# EAGLE schematic controll_8motor_dac (EAGLE 9.3.2)
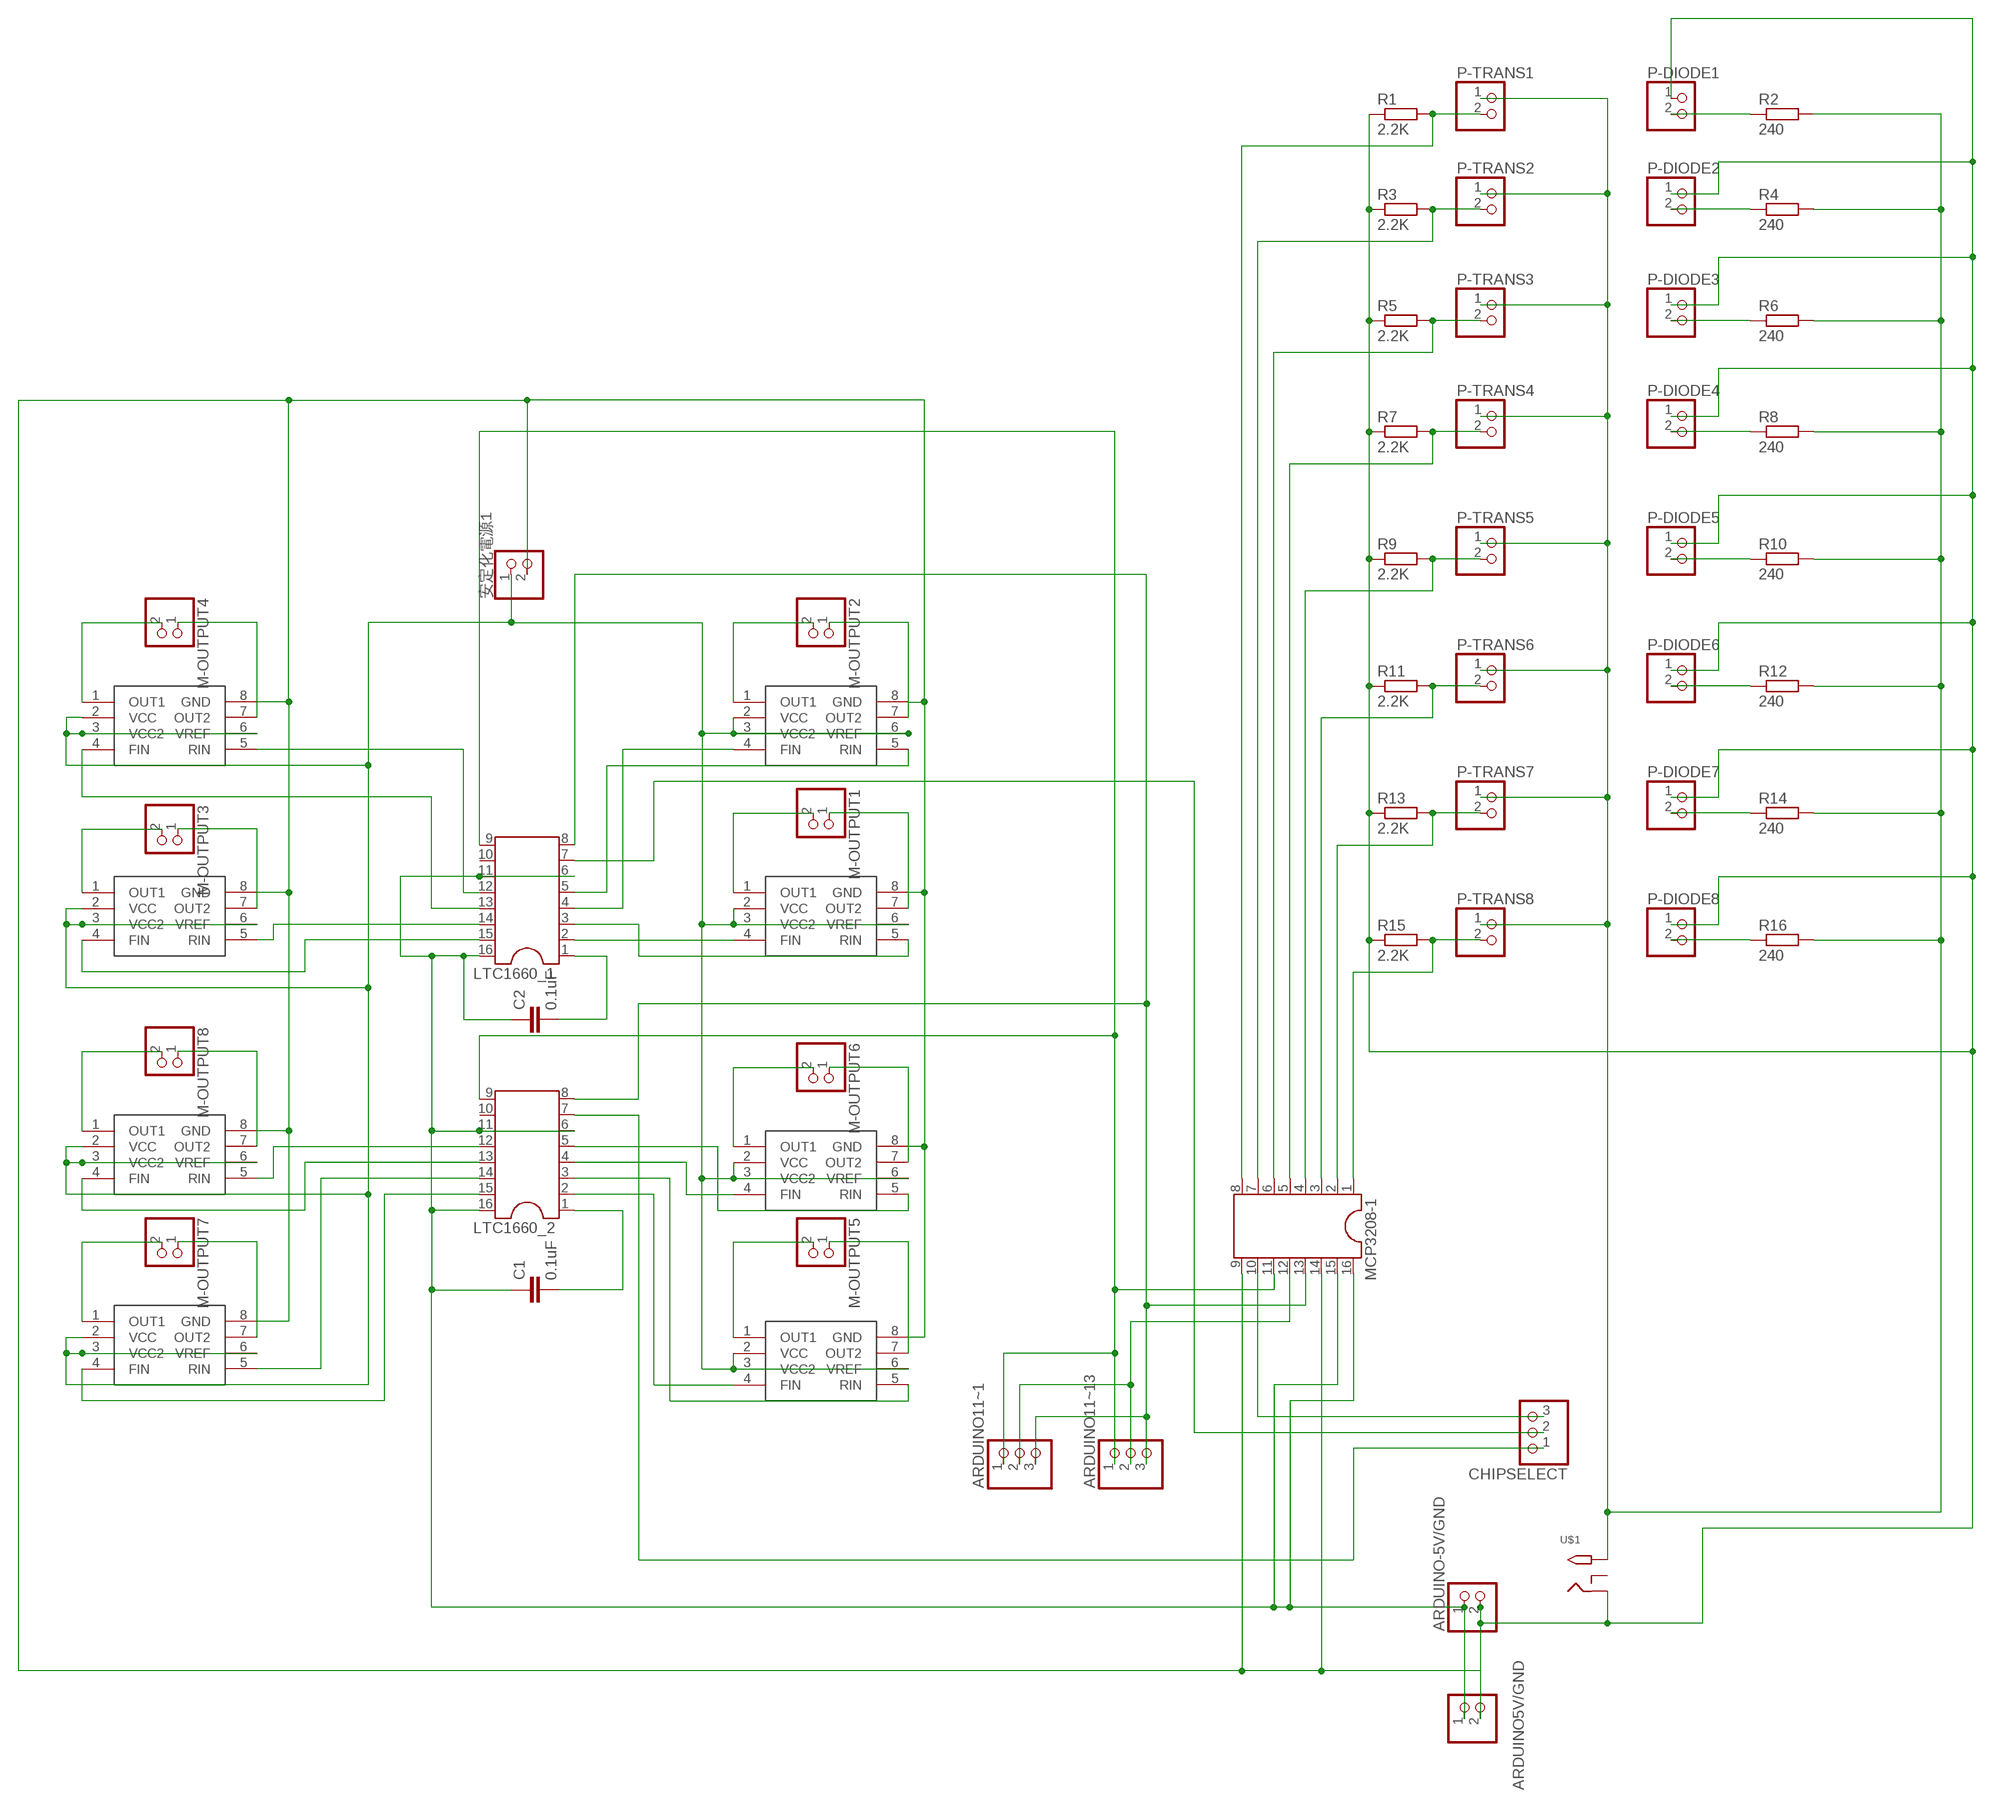
[diagram p0: schematic, sheet 1]

## Parts
ARDUINO5V/GND  PINHD-1X2  [1X02]
ARDUINO11~1  PINHD-1X3  [1X03]
ARDUINO11~13  PINHD-1X3  [1X03]
ARDUINO-5V/GND  PINHD-1X2  [1X02]
C1  0.1uF  C-EU025-024X044  [C025-024X044]
C2  0.1uF  C-EU025-024X044  [C025-024X044]
CHIPSELECT  PINHD-1X3  [1X03]
LTC1660_1  DIL16S  [SOCKET-16]
LTC1660_2  DIL16S  [SOCKET-16]
M-DRIVER_1  BD6211F-E2  [BD6211F-E2]
M-DRIVER_2  BD6211F-E2  [BD6211F-E2]
M-DRIVER_3  BD6211F-E2  [BD6211F-E2]
M-DRIVER_4  BD6211F-E2  [BD6211F-E2]
M-DRIVER_5  BD6211F-E2  [BD6211F-E2]
M-DRIVER_6  BD6211F-E2  [BD6211F-E2]
M-DRIVER_7  BD6211F-E2  [BD6211F-E2]
M-DRIVER_8  BD6211F-E2  [BD6211F-E2]
M-OUTPUT1  PINHD-1X2  [1X02]
M-OUTPUT2  PINHD-1X2  [1X02]
M-OUTPUT3  PINHD-1X2  [1X02]
M-OUTPUT4  PINHD-1X2  [1X02]
M-OUTPUT5  PINHD-1X2  [1X02]
M-OUTPUT6  PINHD-1X2  [1X02]
M-OUTPUT7  PINHD-1X2  [1X02]
M-OUTPUT8  PINHD-1X2  [1X02]
MCP3208‐1  DIL16S  [SOCKET-16]
P-DIODE1  PINHD-1X2  [1X02]
P-DIODE2  PINHD-1X2  [1X02]
P-DIODE3  PINHD-1X2  [1X02]
P-DIODE4  PINHD-1X2  [1X02]
P-DIODE5  PINHD-1X2  [1X02]
P-DIODE6  PINHD-1X2  [1X02]
P-DIODE7  PINHD-1X2  [1X02]
P-DIODE8  PINHD-1X2  [1X02]
P-TRANS1  PINHD-1X2  [1X02]
P-TRANS2  PINHD-1X2  [1X02]
P-TRANS3  PINHD-1X2  [1X02]
P-TRANS4  PINHD-1X2  [1X02]
P-TRANS5  PINHD-1X2  [1X02]
P-TRANS6  PINHD-1X2  [1X02]
P-TRANS7  PINHD-1X2  [1X02]
P-TRANS8  PINHD-1X2  [1X02]
R1  2.2K  R-EU_0204/2V  [0204V]
R2  240  R-EU_0204/2V  [0204V]
R3  2.2K  R-EU_0204/2V  [0204V]
R4  240  R-EU_0204/2V  [0204V]
R5  2.2K  R-EU_0204/2V  [0204V]
R6  240  R-EU_0204/2V  [0204V]
R7  2.2K  R-EU_0204/2V  [0204V]
R8  240  R-EU_0204/2V  [0204V]
R9  2.2K  R-EU_0204/2V  [0204V]
R10  240  R-EU_0204/2V  [0204V]
R11  2.2K  R-EU_0204/2V  [0204V]
R12  240  R-EU_0204/2V  [0204V]
R13  2.2K  R-EU_0204/2V  [0204V]
R14  240  R-EU_0204/2V  [0204V]
R15  2.2K  R-EU_0204/2V  [0204V]
R16  240  R-EU_0204/2V  [0204V]
U$1  2.1MMJACKTHM  [PJ-102A]
安定化電源1  PINHD-1X2  [1X02]

## Nets
ARDUINO-5V/GND: ARDUINO5V/GND.1 ARDUINO-5V/GND.1 C1.1 C2.1 LTC1660_1.6 LTC1660_1.11 LTC1660_1.16 LTC1660_2.6 LTC1660_2.11 LTC1660_2.16 MCP3208‐1.15 MCP3208‐1.16
N$1: LTC1660_1.12 M-DRIVER_4.5(RIN)
N$2: M-DRIVER_4.1(OUT1) M-OUTPUT4.2
N$3: LTC1660_1.13 M-DRIVER_4.4(FIN)
N$4: LTC1660_1.15 M-DRIVER_3.4(FIN)
N$5: LTC1660_2.12 M-DRIVER_8.5(RIN)
N$6: LTC1660_2.13 M-DRIVER_8.4(FIN)
N$7: LTC1660_2.14 M-DRIVER_7.5(RIN)
N$8: LTC1660_2.15 M-DRIVER_7.4(FIN)
N$9: LTC1660_1.5 M-DRIVER_2.5(RIN)
N$10: LTC1660_1.4 M-DRIVER_2.4(FIN)
N$11: LTC1660_1.3 M-DRIVER_1.5(RIN)
N$12: LTC1660_1.2 M-DRIVER_1.4(FIN)
N$13: M-DRIVER_5.1(OUT1) M-OUTPUT5.2
N$14: LTC1660_2.4 M-DRIVER_6.4(FIN)
N$15: LTC1660_2.3 M-DRIVER_5.5(RIN)
N$16: LTC1660_2.2 M-DRIVER_5.4(FIN)
N$17: M-DRIVER_4.7(OUT2) M-OUTPUT4.1
N$18: M-DRIVER_3.7(OUT2) M-OUTPUT3.1
N$19: M-DRIVER_3.1(OUT1) M-OUTPUT3.2
N$20: M-DRIVER_8.7(OUT2) M-OUTPUT8.1
N$21: M-DRIVER_8.1(OUT1) M-OUTPUT8.2
N$22: M-DRIVER_7.7(OUT2) M-OUTPUT7.1
N$23: M-DRIVER_7.1(OUT1) M-OUTPUT7.2
N$24: M-DRIVER_1.7(OUT2) M-OUTPUT1.1
N$25: ARDUINO11~1.1 ARDUINO11~13.1 LTC1660_1.9 LTC1660_2.9 MCP3208‐1.11
N$26: LTC1660_1.14 M-DRIVER_3.5(RIN)
N$27: M-DRIVER_2.7(OUT2) M-OUTPUT2.1
N$28: M-DRIVER_2.1(OUT1) M-OUTPUT2.2
N$29: LTC1660_2.5 M-DRIVER_6.5(RIN)
N$30: M-DRIVER_5.7(OUT2) M-OUTPUT5.1
N$31: M-DRIVER_6.1(OUT1) M-OUTPUT6.2
N$32: M-DRIVER_6.7(OUT2) M-OUTPUT6.1
N$33: M-DRIVER_1.2(VCC) M-DRIVER_1.3(VCC2) M-DRIVER_1.6(VREF) M-DRIVER_2.2(VCC) M-DRIVER_2.3(VCC2) M-DRIVER_2.6(VREF) M-DRIVER_3.2(VCC) M-DRIVER_3.3(VCC2) M-DRIVER_3.6(VREF) M-DRIVER_4.2(VCC) M-DRIVER_4.3(VCC2) M-DRIVER_4.6(VREF) M-DRIVER_5.2(VCC) M-DRIVER_5.3(VCC2) M-DRIVER_5.6(VREF) M-DRIVER_6.2(VCC) M-DRIVER_6.3(VCC2) M-DRIVER_6.6(VREF) M-DRIVER_7.2(VCC) M-DRIVER_7.3(VCC2) M-DRIVER_7.6(VREF) M-DRIVER_8.2(VCC) M-DRIVER_8.3(VCC2) M-DRIVER_8.6(VREF) 安定化電源1.1
N$34: C2.2 LTC1660_1.1
N$35: C1.2 LTC1660_2.1
N$38: ARDUINO11~1.3 ARDUINO11~13.3 LTC1660_1.8 LTC1660_2.8 MCP3208‐1.13
N$39: CHIPSELECT.2 LTC1660_1.7
N$40: M-DRIVER_1.1(OUT1) M-OUTPUT1.2
N$41: CHIPSELECT.1 LTC1660_2.7
N$42: ARDUINO11~1.2 ARDUINO11~13.2 MCP3208‐1.12
N$43: P-DIODE8.2 R16.1
N$44: CHIPSELECT.3 MCP3208‐1.10
N$45: P-DIODE7.2 R14.1
N$46: P-DIODE6.2 R12.1
N$47: P-DIODE5.2 R10.1
N$48: P-DIODE4.2 R8.1
N$49: P-DIODE3.2 R6.1
N$50: P-DIODE2.2 R4.1
N$51: P-DIODE1.2 R2.1
N$52: MCP3208‐1.7 P-TRANS2.2 R3.2
N$53: MCP3208‐1.8 P-TRANS1.2 R1.2
N$54: MCP3208‐1.6 P-TRANS3.2 R5.2
N$55: MCP3208‐1.5 P-TRANS4.2 R7.2
N$56: MCP3208‐1.4 P-TRANS5.2 R9.2
N$57: MCP3208‐1.3 P-TRANS6.2 R11.2
N$58: MCP3208‐1.2 P-TRANS7.2 R13.2
N$59: MCP3208‐1.1 P-TRANS8.2 R15.2
N$97: P-TRANS1.1 P-TRANS2.1 P-TRANS3.1 P-TRANS4.1 P-TRANS5.1 P-TRANS6.1 P-TRANS7.1 P-TRANS8.1 R2.2 R4.2 R6.2 R8.2 R10.2 R12.2 R14.2 R16.2 U$1.TIP
P-DIORD1: ARDUINO5V/GND.2 ARDUINO-5V/GND.2 M-DRIVER_1.8(GND) M-DRIVER_2.8(GND) M-DRIVER_3.8(GND) M-DRIVER_4.8(GND) M-DRIVER_5.8(GND) M-DRIVER_6.8(GND) M-DRIVER_7.8(GND) M-DRIVER_8.8(GND) MCP3208‐1.9 MCP3208‐1.14 P-DIODE1.1 P-DIODE2.1 P-DIODE3.1 P-DIODE4.1 P-DIODE5.1 P-DIODE6.1 P-DIODE7.1 P-DIODE8.1 R1.1 R3.1 R5.1 R7.1 R9.1 R11.1 R13.1 R15.1 U$1.RING 安定化電源1.2
Unconnected: LTC1660_1.10 LTC1660_2.10 U$1.RING_SW

## Library data of the parts
ARDUINO5V/GND ARDUINO-5V/GND M-OUTPUT1-M-OUTPUT8 P-DIODE1-P-DIODE8 P-TRANS1-P-TRANS8 安定化電源1 = pinhead:PINHD-1X2: PIN HEADER
ARDUINO11~1 ARDUINO11~13 CHIPSELECT = pinhead:PINHD-1X3: PIN HEADER
C1 C2 = rcl:C-EU: CAPACITOR, European symbol; SPICEPREFIX: C
LTC1660_1 LTC1660_2 MCP3208‐1 = ic-package:DIL16: Dual In Line / Socket
M-DRIVER_1-M-DRIVER_8 = BD6211F:BD6211F-E2: BD6211F motor driver 7V
R1-R16 = rcl:R-EU_: RESISTOR, European symbol; SPICEPREFIX: R
U$1 = adafruit:2.1MMJACK: 2.1mm x 5.5mm THM DC jack with internal switch. Digikey part #PJ-102A, 4UCON part #05537 2.1mm x 5.5mm SMT DC jack with internal switch. Digikey part #PJ-002A-SMT, 4UCON part #03267 By microbuilder.eu & adafruit.com

## Net classes
0 default: clearance 0.205 mm